# Altium project ENGG2800PCBSCHV3.PrjPcb (part 1 of 2)
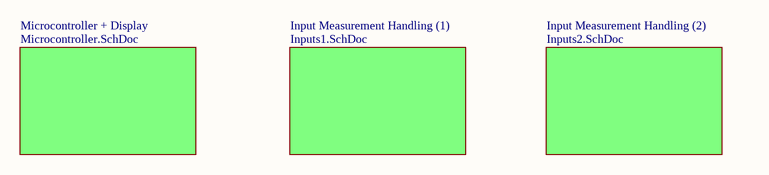
[diagram p0: TopSheet.SchDoc]
4 sheets, 121 parts. Net scope: global (net labels, ports and power ports of the same name join across sheets).
Board file: PCB1.PcbDoc
Sheets:
  TopSheet.SchDoc
    Microcontroller + Display = Microcontroller.SchDoc
    Input Measurement Handling (1) = Inputs1.SchDoc
    Input Measurement Handling (2) = Inputs2.SchDoc

## Sheet TopSheet.SchDoc
size A4; SheetNumber: 1; SheetTotal: 4

### Sub-sheets
Input Measurement Handling (1) = Inputs1.SchDoc: no entries
Input Measurement Handling (2) = Inputs2.SchDoc: no entries
Microcontroller + Display = Microcontroller.SchDoc: no entries

## Sheet Microcontroller.SchDoc
size A4; SheetNumber: 2; SheetTotal: 4
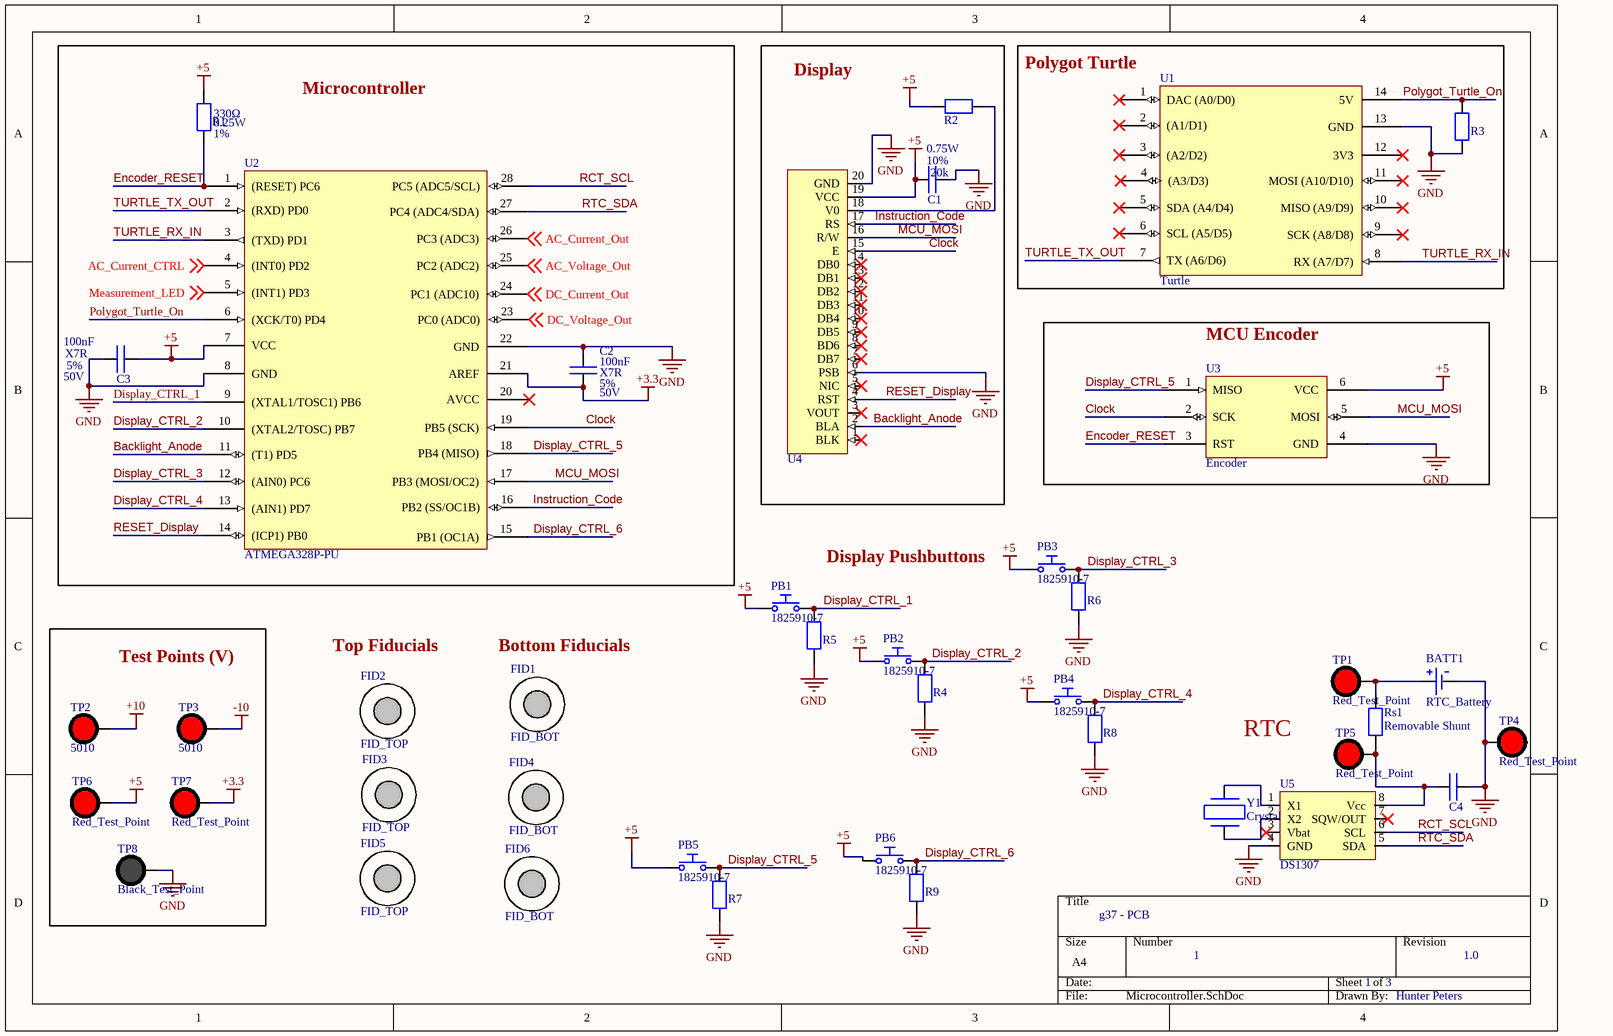
[diagram p1: Microcontroller.SchDoc]

### Parts
BATT1  RTC_Battery  [Battery Holder]
C1  Capacitor  [Capacitor]  (value not drawn)
C2  Capacitor  [Capacitor]  (value not drawn)
C3  Capacitor  [Capacitor]  (value not drawn)
C4  Capacitor  [Capacitor]  (value not drawn)
FID1  FID_BOT  [Fiducial_TOP]
FID2  FID_TOP  [Fiducial_TOP]
FID3  FID_TOP  [Fiducial_TOP]
FID4  FID_BOT  [Fiducial_TOP]
FID5  FID_TOP  [Fiducial_TOP]
FID6  FID_BOT  [Fiducial_TOP]
PB1  1825910-7  [Pushbutton]
PB2  1825910-7  [Pushbutton]
PB3  1825910-7  [Pushbutton]
PB4  1825910-7  [Pushbutton]
PB5  1825910-7  [Pushbutton]
PB6  1825910-7  [Pushbutton]
R1  Resistor  [Resistor]  (value not drawn)
R2  Resistor  [Resistor]  (value not drawn)
R3  Resistor  [Resistor]  (value not drawn)
R4  Resistor  [Resistor]  (value not drawn)
R5  Resistor  [Resistor]  (value not drawn)
R6  Resistor  [Resistor]  (value not drawn)
R7  Resistor  [Resistor]  (value not drawn)
R8  Resistor  [Resistor]  (value not drawn)
R9  Resistor  [Resistor]  (value not drawn)
Rs1  Removable Shunt  [Current_Shunt]
TP1  Red_Test_Point  [TP]
TP2  5010  [TP]
TP3  5010  [TP]
TP4  Red_Test_Point  [TP]
TP5  Red_Test_Point  [TP]
TP6  Red_Test_Point  [TP]
TP7  Red_Test_Point  [TP]
TP8  Black_Test_Point  [TP]
U1  Turtle  [Polygot-Turtle]
U2  ATMEGA328P-PU  [ATMEGA832P\]
U3  Encoder  [Encoder_No_Breakout]
U4  LED Display  [LED Display]  (value not drawn)
U5  DS1307  [Op Amp]
Y1  Crystal  [Crystal]

### Blocks framed on the sheet
Microcontroller: C2 C3 R1 U2
Display: C1 R2 U4
Polygot Turtle: R3 U1
MCU Encoder: U3
Test Points (V): TP2 TP3 TP6-TP8

### Nets
+3.3: C2.1 TP7.1 U2.21(AREF)
+5: C1.1 C3.1 PB1.1 PB2.1 PB3.1 PB4.1 PB5.1 PB6.1 R1.1 R2.1 TP6.1 U2.7(VCC) U3.6(VCC) U4.19(VCC)
+10: TP2.1
-10: TP3.1
GND: BATT1.2 C1.2 C2.2 C3.2 C4.2 R3.1 R4.1 R5.1 R6.1 R7.1 R8.1 R9.1 TP4.1 TP8.1 U1.13(GND) U2.8(GND) U2.22(GND) U3.4(GND) U4.6(PSB) U4.20(GND) U5.4(GND)
AC_Current_CTRL: U2.4((INT0)_PD2) ; off-sheet AC_Current_CTRL
AC_Current_Out: U2.26(PC3_(ADC3)) ; off-sheet AC_Current_Out
AC_Voltage_Out: U2.25(PC2_(ADC2)) ; off-sheet AC_Voltage_Out
Backlight_Anode: U2.11((T1)_PD5) U4.2(BLA)
Clock: U2.19(PB5_(SCK)) U3.2(SCK) U4.15(E)
DC_Current_Out: U2.24(PC1_(ADC10)) ; off-sheet DC_Current_Out
DC_Voltage_Out: U2.23(PC0_(ADC0)) ; off-sheet DC_Voltage_Out
Display_CTRL_1: PB1.2 R5.2 U2.9((XTAL1/TOSC1)_PB6)
Display_CTRL_2: PB2.2 R4.2 U2.10((XTAL2/TOSC)_PB7)
Display_CTRL_3: PB3.2 R6.2 U2.12((AIN0)_PC6)
Display_CTRL_4: PB4.2 R8.2 U2.13((AIN1)_PD7)
Display_CTRL_5: PB5.2 R7.2 U2.18(PB4_(MISO)) U3.1(MISO)
Display_CTRL_6: PB6.2 R9.2 U2.15(PB1_(OC1A))
Encoder_RESET: R1.2 U2.1((RESET)_PC6) U3.3(RST)
Instruction_Code: U2.16(PB2_(SS/OC1B)) U4.17(RS)
MCU_MOSI: U2.17(PB3_(MOSI/OC2)) U3.5(MOSI) U4.16(R/W)
Measurement_LED: U2.5((INT1)_PD3) ; off-sheet Measurement_LED
Polygot_Turtle_On: R3.2 U1.14(5V) U2.6((XCK/T0)_PD4)
RCT_SCL: U2.28(PC5_(ADC5/SCL)) U5.6(SCL)
RESET_Display: U2.14((ICP1)_PB0) U4.4(RST)
RTC_SDA: U2.27(PC4_(ADC4/SDA)) U5.5(SDA)
TURTLE_RX_IN: U1.8(RX_(A7/D7)) U2.3((TXD)_PD1)
TURTLE_TX_OUT: U1.7(TX_(A6/D6)) U2.2((RXD)_PD0)
NetBATT1_1: BATT1.1 Rs1.2 TP1.1
NetC4_1: C4.1 Rs1.1 TP5.1 U5.8(Vcc)
NetR2_2: R2.2 U4.18(V0)
NetU5_1: U5.1(X1) Y1.2
NetU5_2: U5.2(X2) Y1.1

Not connected (* = marked no-connect by the designer): U1 1(DAC_(A0/D0))* 2((A1/D1))* 3((A2/D2))* 4((A3/D3))* 5(SDA_(A4/D4))* 6(SCL_(A5/D5))* 9(SCK_(A8/D8))* 10(MISO_(A9/D9))* 11(MOSI_(A10/D10))* 12(3V3)*; U2 20(AVCC)*; U4 1(BLK)* 3(VOUT)* 5(NIC)* 7(DB7)* 8(BD6)* 9(DB5)* 10(DB4)* 11(DB3)* 12(DB2)* 13(DB1)* 14(DB0)*; U5 3(Vbat)* 7(SQW/OUT)*

### Notes on the sheet
- (near R1) 330Ω
- (near R1) 0.25W
- (near R1) 1%
- 0.75W
- (near C1) 10%
- (near C1) 20k
- (near C3) 100nF
- (near C3) 50V
- (near C3) X7R
- (near C3) 5%
- (near C2) 100nF
- (near C2) X7R
- (near C2) 5%
- (near C2) 50V
- Display Pushbuttons
- Top Fiducials
- (near FID1) Bottom Fiducials
- RTC
- g37 - PCB
- 1
- 3
- 1.0
- Hunter Peters

### Library data of the parts
FID1 FID4 FID6 = FID_Bottom
PB1-PB6 = 1825910-7: Keypad Switch, 1 Switches, SPST, Momentary, 0.05A, 24VDC, 2.548N, Solder Terminal, Panel Mount; Manufacturer: TE Connectivity; Manufacturer Lifecycle Status: ACTIVE; Actuator Length: 1.397mm; Actuator Material: PBT; Contact Current Rating: 50mA; Contact Resistance: 100mΩ; Electrical Life: 100kcycles; Illumination Type: Illuminated, Non-Illuminated; Max Voltage Rating (DC): 24V; Number of Positions: 1; Switch Function: Off-Mom; Switch Travel: 250µm; Supplier 1: DigiKey; Manufacturer Part Number: 1825910-7; RoHS: Compliant; Category: Pushbutton Switches; Stock 1: 35870; Pricing 1: 1=0.13, 10=0.118, 25=0.1112, 100=0.1001, 250=0.093, 750=0.08485, 1500=0.08009, 3000=0.07565, 5250=0.07234 (USD); China RoHS: Compliant; Color: Black, Red; Contact Material: Silver; Contact Plating: Silver; Current Rating: 50mA; Depth: 7.8mm; Export Control Classification Number (ECCN) Code: EAR99; ELV: Compliant; Height: 3.61mm; Housing Material: Nylon; Harmonized Tariff Schedule (HTS) Code: 8536.50.90.40; Introduction Date: 2008-01-30; Lead Free: Lead Free; Length: 5.99mm; Lifecycle Status: Production; Max Current Rating: 50mA; Max Operating Temperature: 85°C; Mechanical Life: 100kcycles; Min Operating Temperature: -35°C; Mount: Surface Mount, Through Hole; Operating Force: 2.548N; Orientation: Straight; Packaging: Bulk; Radiation Hardening: No; REACH SVHC: Yes; Schedule B: 8536509065, 8536509065|8536509065|8536509065|8536509065|8536509065|8536509065|8536509065|8536509065|8536509065|8536509065|8536509065|8536509065|8536509065|8536509065|8536509065|8536509065|8536509065|8536509065|8536509065|8536509065|8536509065|8536509065|8536509065|85; Termination: PC Pins, Solder; Throw Configuration: SPST; Type: Switch; Voltage Rating (DC): 24V; ComponentLink1URL: https://datasheet.octopart.com:443/1825910-7-TE-Connectivity-datasheet-179971976.pdf?src-supplier=IHS; ComponentLink1Description: https://datasheet.octopart.com:443/1825910-7-TE-Connectivity-datasheet-179971976.pdf?src-supplier=IHS; ComponentLink2URL: https://sigma.octopart.com:443/101748000/technical_drawing/TE-Connectivity-1825910-7.pdf?src-supplier=Sager+Electronics; ComponentLink2Description: https://sigma.octopart.com:443/101748000/technical_drawing/TE-Connectivity-1825910-7.pdf?src-supplier=Sager+Electronics; ComponentLink3URL: https://sigma.octopart.com:443/12291753/technical_drawing/TE-Connectivity-1825910-7.pdf?src-supplier=TE+Connectivity; ComponentLink3Description: https://sigma.octopart.com:443/12291753/technical_drawing/TE-Connectivity-1825910-7.pdf?src-supplier=TE+Connectivity; ComponentLink4URL: https://datasheet.octopart.com:443/1825910-7-TE-Connectivity-datasheet-10294628.pdf?src-supplier=Newark; ComponentLink4Description: https://datasheet.octopart.com:443/1825910-7-TE-Connectivity-datasheet-10294628.pdf?src-supplier=Newark; ComponentLink5URL: https://sigma.octopart.com:443/58177301/technical_drawing/TE-Connectivity-1825910-7.pdf?src-supplier=Farnell; ComponentLink5Description: https://sigma.octopart.com:443/58177301/technical_drawing/TE-Connectivity-1825910-7.pdf?src-supplier=Farnell; ComponentLink6URL: https://datasheet.octopart.com:443/1825910-7-TE-Connectivity---Alcoswitch-datasheet-33021037.pdf?src-supplier=Farnell; ComponentLink6Description: https://datasheet.octopart.com:443/1825910-7-TE-Connectivity---Alcoswitch-datasheet-33021037.pdf?src-supplier=Farnell; ComponentLink7URL: https://datasheet.octopart.com:443/1825910-7-TE-Connectivity---AMP-datasheet-23715109.pdf?src-supplier=Electro+Sonic; ComponentLink7Description: https://datasheet.octopart.com:443/1825910-7-TE-Connectivity---AMP-datasheet-23715109.pdf?src-supplier=Electro+Sonic; ComponentLink8URL: https://datasheet.octopart.com:443/1825910-7-TE-Connectivity-datasheet-145419879.pdf?src-supplier=RS+(Formerly+Allied+Electronics); ComponentLink8Description: https://datasheet.octopart.com:443/1825910-7-TE-Connectivity-datasheet-145419879.pdf?src-supplier=RS+(Formerly+Allied+Electronics); ComponentLink9URL: https://datasheet.octopart.com:443/1825910-7-TE-Connectivity---AMP-datasheet-189108451.pdf?src-supplier=Master+Electronics; ComponentLink9Description: https://datasheet.octopart.com:443/1825910-7-TE-Connectivity---AMP-datasheet-189108451.pdf?src-supplier=Master+Electronics; ComponentLink10URL: http://sigma.octopart.com:80/14574254/rohs_statement/TE-Connectivity-1825910-7.pdf?src-supplier=Compliance+Statements; ComponentLink10Description: http://sigma.octopart.com:80/14574254/rohs_statement/TE-Connectivity-1825910-7.pdf?src-supplier=Compliance+Statements; ComponentLink11URL: http://sigma.octopart.com:80/41598134/materials_sheet/TE-Connectivity-1825910-7.pdf?src-supplier=Compliance+Statements; ComponentLink11Description: http://sigma.octopart.com:80/41598134/materials_sheet/TE-Connectivity-1825910-7.pdf?src-supplier=Compliance+Statements; Supplier Part Number 1: 450-1804-ND
Rs1 = Current_Test_Shunt: Current_Shunt
TP2 TP3 = Red_Test_Point
U1 = 102010328: SAMD21 Microcontroller Development Board 0.0327MHz/48MHzCPU 32KB RAM 256KB Flash; Manufacturer: Seeed Studio; Supplier 1: DigiKey; Manufacturer Part Number: 102010328; Category: DSPs - Digital Signal Processors; Stock 1: 4270; Pricing 1: 1=5.4 (USD); Schedule B: 8471490000; Supplier Part Number 1: 1597-102010328-ND
U2 = ATMEGA328P-PU: Microchip - ATMEGA328P-PU - Microcontroller Mcu, 8 Bit, Atmega, 20MHZ, DIP-28; Manufacturer Lifecycle Status: REL; Core Architecture: AVR; Data Bus Width: 8b; Interface: 2-Wire, I2C, SPI, UART, USART; Max Supply Voltage: 5.5V; Memory Size: 32kB; Memory Type: FLASH; Min Supply Voltage: 1.8V; Number of ADC Channels: 6; Number of I2C Channels: 1; Number of I/Os: 23; Number of Timers/Counters: 3; Oscillator Type: Internal; Peripherals: Brown-out Detect/Reset, POR, PWM, WDT; RAM Size: 2kB; Watchdog Timer: Yes; Supplier 1: DigiKey; Manufacturer: Microchip; Manufacturer Part Number: ATMEGA328P-PU; RoHS: Compliant; Category: Microcontrollers; Stock 1: 49916; Pricing 1: 1=2.89, 25=2.65, 100=2.39 (USD); Projected EOL Date: 2039-11-04; Case/Package: PDIP; Contact Plating: Tin; Country of Assembly: Thailand; Country of Fabrication: United States of America; Country of Origin: Thailand; Export Control Classification Number (ECCN) Code: EAR99; Frequency: 20MHz; Height: 3.28mm; Harmonized Tariff Schedule (HTS) Code: 8542.31.0015; Lead Free: Lead Free; Length: 37.4mm; Lifecycle Status: Production; Max Frequency: 20MHz; Max Operating Temperature: 85°C; Min Operating Temperature: -40°C; Mount: Through Hole; Number of Pins: 28; Number of Programmable I/O: 23; Number of PWM Channels: 6; Number of SPI Channels: 1; Radiation Hardening: No; REACH SVHC: No; Schedule B: 8542310000, 8542310000|8542310000|8542310000|8542310000|8542310000; Width: 6.76mm; ComponentLink1URL: https://datasheet.octopart.com:443/ATMEGA328P-PU-Microchip-datasheet-147334532.pdf?src-supplier=Microchip; ComponentLink1Description: https://datasheet.octopart.com:443/ATMEGA328P-PU-Microchip-datasheet-147334532.pdf?src-supplier=Microchip; ComponentLink2URL: https://datasheet.octopart.com:443/ATMEGA328P-PU-Microchip-datasheet-148646239.pdf?src-supplier=Microchip; ComponentLink2Description: https://datasheet.octopart.com:443/ATMEGA328P-PU-Microchip-datasheet-148646239.pdf?src-supplier=Microchip; ComponentLink3URL: https://datasheet.octopart.com:443/ATMEGA328P-PU-Microchip-datasheet-68295846.pdf?src-supplier=SHENGYU+ELECTRONICS; ComponentLink3Description: https://datasheet.octopart.com:443/ATMEGA328P-PU-Microchip-datasheet-68295846.pdf?src-supplier=SHENGYU+ELECTRONICS; ComponentLink4URL: https://datasheet.octopart.com:443/ATMEGA328P-PU-Microchip-datasheet-14421303.pdf?src-supplier=Upverter; ComponentLink4Description: https://datasheet.octopart.com:443/ATMEGA328P-PU-Microchip-datasheet-14421303.pdf?src-supplier=Upverter; ComponentLink5URL: https://datasheet.octopart.com:443/ATMEGA328P-PU-Atmel-datasheet-34147914.pdf?src-supplier=Upverter; ComponentLink5Description: https://datasheet.octopart.com:443/ATMEGA328P-PU-Atmel-datasheet-34147914.pdf?src-supplier=Upverter; ComponentLink6URL: https://datasheet.octopart.com:443/ATMEGA328P-PU-Atmel-datasheet-14353408.pdf?src-supplier=Upverter; ComponentLink6Description: https://datasheet.octopart.com:443/ATMEGA328P-PU-Atmel-datasheet-14353408.pdf?src-supplier=Upverter; ComponentLink7URL: https://datasheet.octopart.com:443/ATMEGA328P-PU-Microchip-datasheet-133520744.pdf?src-supplier=LKR; ComponentLink7Description: https://datasheet.octopart.com:443/ATMEGA328P-PU-Microchip-datasheet-133520744.pdf?src-supplier=LKR; ComponentLink8URL: https://datasheet.octopart.com:443/ATMEGA328P-PU-Microchip-datasheet-62316222.pdf?src-supplier=element14+APAC; ComponentLink8Description: https://datasheet.octopart.com:443/ATMEGA328P-PU-Microchip-datasheet-62316222.pdf?src-supplier=element14+APAC; ComponentLink9URL: https://datasheet.octopart.com:443/ATMEGA328P-PU-Atmel-datasheet-13381135.pdf?src-supplier=element14+APAC; ComponentLink9Description: https://datasheet.octopart.com:443/ATMEGA328P-PU-Atmel-datasheet-13381135.pdf?src-supplier=element14+APAC; ComponentLink10URL: https://datasheet.octopart.com:443/ATMEGA328P-PU-Microchip-datasheet-154741723.pdf?src-supplier=Electro+Sonic; ComponentLink10Description: https://datasheet.octopart.com:443/ATMEGA328P-PU-Microchip-datasheet-154741723.pdf?src-supplier=Electro+Sonic; ComponentLink11URL: https://datasheet.octopart.com:443/ATMEGA328P-PU-Microchip-datasheet-100453898.pdf?src-supplier=Burklin+Elektronik; ComponentLink11Description: https://datasheet.octopart.com:443/ATMEGA328P-PU-Microchip-datasheet-100453898.pdf?src-supplier=Burklin+Elektronik; ComponentLink12URL: https://datasheet.octopart.com:443/ATMEGA328P-PU-Atmel-datasheet-30457899.pdf?src-supplier=Seeed+Studio; ComponentLink12Description: https://datasheet.octopart.com:443/ATMEGA328P-PU-Atmel-datasheet-30457899.pdf?src-supplier=Seeed+Studio; ComponentLink13URL: https://datasheet.octopart.com:443/ATMEGA328P-PU-Microchip-datasheet-10842036.pdf?src-supplier=SOS+electronic; ComponentLink13Description: https://datasheet.octopart.com:443/ATMEGA328P-PU-Microchip-datasheet-10842036.pdf?src-supplier=SOS+electronic; ComponentLink14URL: https://datasheet.octopart.com:443/ATMEGA328P-PU-Microchip-datasheet-8364063.pdf?src-supplier=Jameco; ComponentLink14Description: https://datasheet.octopart.com:443/ATMEGA328P-PU-Microchip-datasheet-8364063.pdf?src-supplier=Jameco; ComponentLink15URL: https://datasheet.octopart.com:443/ATMEGA328P-PU-Microchip-datasheet-154323124.pdf?src-supplier=Jameco; ComponentLink15Description: https://datasheet.octopart.com:443/ATMEGA328P-PU-Microchip-datasheet-154323124.pdf?src-supplier=Jameco; ComponentLink16URL: https://datasheet.octopart.com:443/ATMEGA328P-PU-Atmel-datasheet-10389530.pdf?src-supplier=Newark; ComponentLink16Description: https://datasheet.octopart.com:443/ATMEGA328P-PU-Atmel-datasheet-10389530.pdf?src-supplier=Newark; ComponentLink17URL: https://datasheet.octopart.com:443/ATMEGA328P-PU-Microchip-datasheet-65729177.pdf?src-supplier=TME; ComponentLink17Description: https://datasheet.octopart.com:443/ATMEGA328P-PU-Microchip-datasheet-65729177.pdf?src-supplier=TME; ComponentLink18URL: https://datasheet.octopart.com:443/ATMEGA328P-PU-Microchip-datasheet-101746195.pdf?src-supplier=Future+Electronics; ComponentLink18Description: https://datasheet.octopart.com:443/ATMEGA328P-PU-Microchip-datasheet-101746195.pdf?src-supplier=Future+Electronics; ComponentLink19URL: http://sigma.octopart.com:80/188450569/materials_sheet/Microchip-ATMEGA328P-PU.pdf?src-supplier=Compliance+Statements; ComponentLink19Description: http://sigma.octopart.com:80/188450569/materials_sheet/Microchip-ATMEGA328P-PU.pdf?src-supplier=Compliance+Statements; ComponentLink20URL: http://sigma.octopart.com:80/rohs_statement/Microchip-company-71.pdf?src-supplier=Compliance+Statements; ComponentLink20Description: http://sigma.octopart.com:80/rohs_statement/Microchip-company-71.pdf?src-supplier=Compliance+Statements; ComponentLink21URL: http://sigma.octopart.com:80/reach_statement/Microchip-company-70.pdf?src-supplier=Compliance+Statements; ComponentLink21Description: http://sigma.octopart.com:80/reach_statement/Microchip-company-70.pdf?src-supplier=Compliance+Statements; ComponentLink22URL: http://sigma.octopart.com:80/conflict_mineral_statement/Microchip-company-69.pdf?src-supplier=Compliance+Statements; ComponentLink22Description: http://sigma.octopart.com:80/conflict_mineral_statement/Microchip-company-69.pdf?src-supplier=Compliance+Statements; ComponentLink23URL: http://sigma.octopart.com:80/conflict_mineral_statement/Microchip-company-68.pdf?src-supplier=Compliance+Statements; ComponentLink23Description: http://sigma.octopart.com:80/conflict_mineral_statement/Microchip-company-68.pdf?src-supplier=Compliance+Statements; ComponentLink24URL: http://sigma.octopart.com:80/reach_statement/Atmel-company-6.pdf?src-supplier=Compliance+Statements; ComponentLink24Description: http://sigma.octopart.com:80/reach_statement/Atmel-company-6.pdf?src-supplier=Compliance+Statements; ComponentLink25URL: http://sigma.octopart.com:80/rohs_statement/Atmel-company-5.pdf?src-supplier=Compliance+Statements; ComponentLink25Description: http://sigma.octopart.com:80/rohs_statement/Atmel-company-5.pdf?src-supplier=Compliance+Statements; ComponentLink26URL: http://sigma.octopart.com:80/rohs_statement/Atmel-company-4.pdf?src-supplier=Compliance+Statements; ComponentLink26Description: http://sigma.octopart.com:80/rohs_statement/Atmel-company-4.pdf?src-supplier=Compliance+Statements; Supplier Part Number 1: ATMEGA328P-PU-ND
U3 = 1465: Adafruit 6-Pin Avr Isp Breadboard Adapter Mini Kit |Adafruit 1465; Manufacturer: Adafruit Industries; Supplier 1: DigiKey; Manufacturer Part Number: 1465; RoHS: Compliant; Category: Uncategorized; Stock 1: 113; Pricing 1: 1=0.95 (USD); Schedule B: 8542900000, 8542900000|8542900000|8542900000|8542900000|8542900000; Supplier Part Number 1: 1528-1189-ND
U4 = Display
U5 = RTC

## Sheet Inputs1.SchDoc
size A4; SheetNumber: 3; SheetTotal: 4
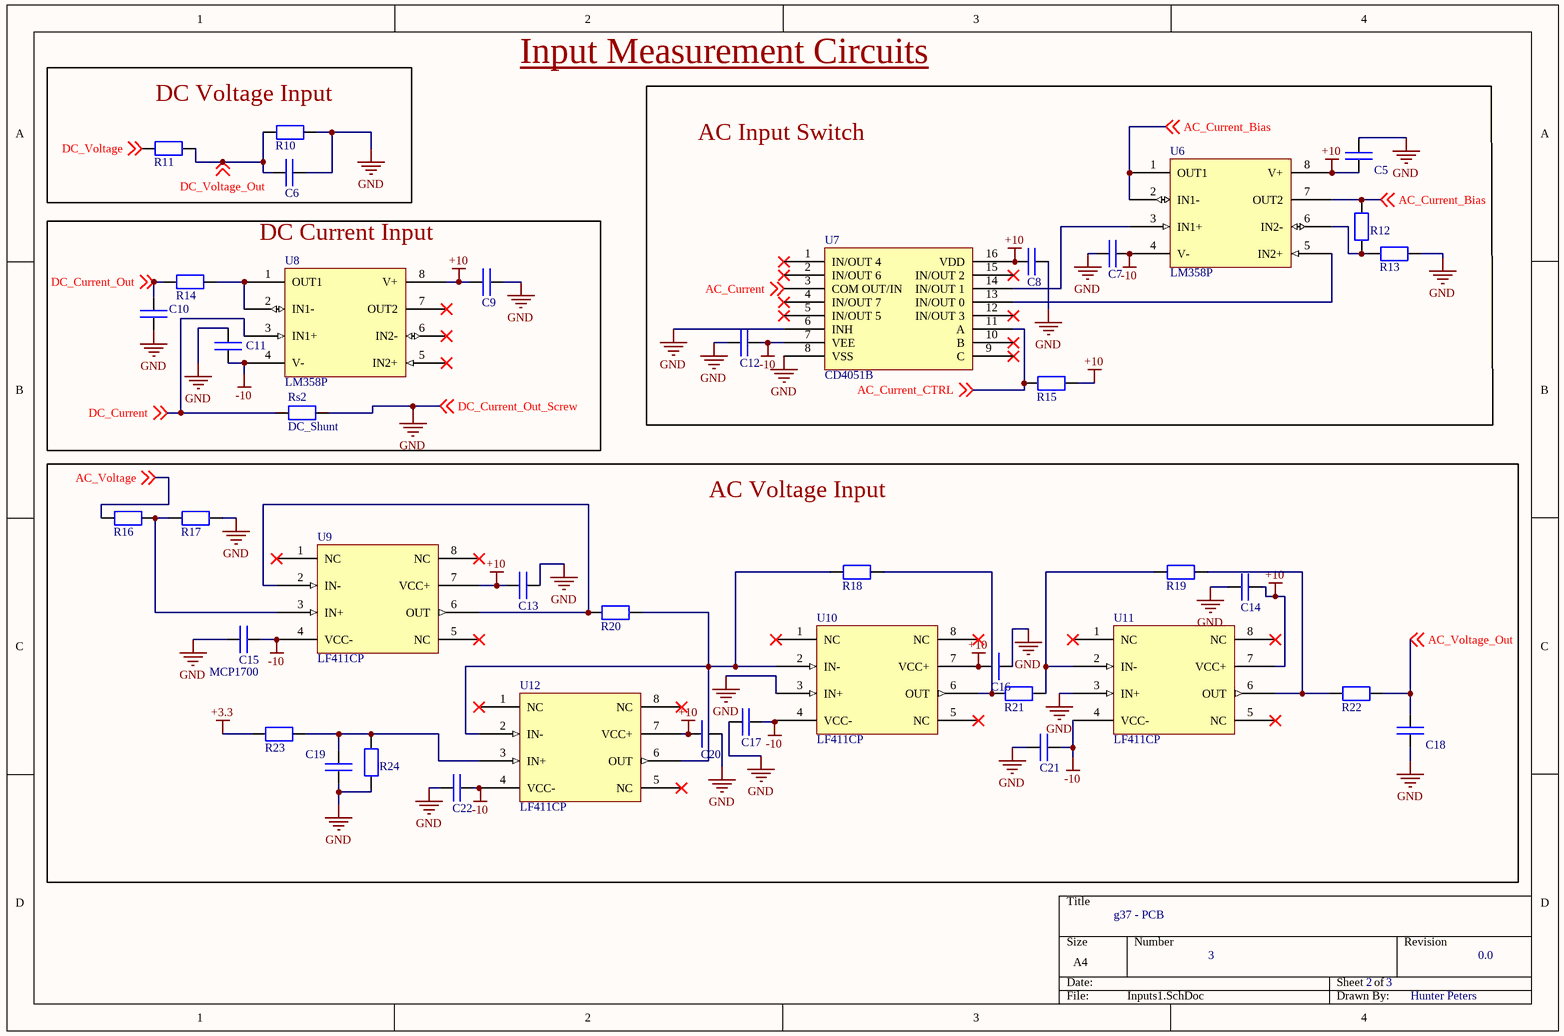
[diagram p2: Inputs1.SchDoc]

### Parts
C5  Capacitor  [Capacitor]  (value not drawn)
C6  Capacitor  [Capacitor]  (value not drawn)
C7  Capacitor  [Capacitor]  (value not drawn)
C8  Capacitor  [Capacitor]  (value not drawn)
C9  Capacitor  [Capacitor]  (value not drawn)
C10  Capacitor  [Capacitor]  (value not drawn)
C11  Capacitor  [Capacitor]  (value not drawn)
C12  Capacitor  [Capacitor]  (value not drawn)
C13  Capacitor  [Capacitor]  (value not drawn)
C14  Capacitor  [Capacitor]  (value not drawn)
C15  Capacitor  [Capacitor]  (value not drawn)
C16  Capacitor  [Capacitor]  (value not drawn)
C17  Capacitor  [Capacitor]  (value not drawn)
C18  Capacitor  [Capacitor]  (value not drawn)
C19  Capacitor  [Capacitor]  (value not drawn)
C20  Capacitor  [Capacitor]  (value not drawn)
C21  Capacitor  [Capacitor]  (value not drawn)
C22  Capacitor  [Capacitor]  (value not drawn)
R10  Resistor  [Resistor]  (value not drawn)
R11  Resistor  [Resistor]  (value not drawn)
R12  Resistor  [Resistor]  (value not drawn)
R13  Resistor  [Resistor]  (value not drawn)
R14  Resistor  [Resistor]  (value not drawn)
R15  4.7kΩ  [Resistor]  (value not drawn)
R16  Resistor  [Resistor]  (value not drawn)
R17  Resistor  [Resistor]  (value not drawn)
R18  Resistor  [Resistor]  (value not drawn)
R19  Resistor  [Resistor]  (value not drawn)
R20  Resistor  [Resistor]  (value not drawn)
R21  Resistor  [Resistor]  (value not drawn)
R22  Resistor  [Resistor]  (value not drawn)
R23  Resistor  [Resistor]  (value not drawn)
R24  Resistor  [Resistor]  (value not drawn)
Rs2  DC_Shunt  [DC_Shunt]
U6  LM358P  [Op Amp]
U7  CD4051B  [Multiplexor]
U8  LM358P  [Op Amp]
U9  LF411CP  [Op Amp]
U10  LF411CP  [Op Amp]
U11  LF411CP  [Op Amp]
U12  LF411CP  [Op Amp]

### Blocks framed on the sheet
DC Voltage Input: C6 R10 R11
AC Input Switch: C5 C7 C8 C12 R12 R13 R15 U6 U7
DC Current Input: C9-C11 R14 Rs2 U8
AC Voltage Input: C13-C22 R16-R24 U9-U12

### Nets
+3.3: R23.1
+10: C5.1 C8.1 C9.1 C13.1 C14.1 C16.1 C20.1 R15.2 U6.8(V+) U7.16(VDD) U8.8(V+) U9.7(VCC+) U10.7(VCC+) U11.7(VCC+) U12.7(VCC+)
-10: C7.2 C11.1 C12.2 C15.2 C17.2 C21.2 C22.2 U6.4(V-) U7.7(VEE) U8.4(V-) U9.4(VCC-) U10.4(VCC-) U11.4(VCC-) U12.4(VCC-)
GND: C5.2 C6.2 C7.1 C8.2 C9.2 C10.1 C11.2 C12.1 C13.2 C14.2 C15.1 C16.2 C17.1 C18.1 C19.1 C20.2 C21.1 C22.1 R10.2 R13.1 R17.2 R24.1 Rs2.2 U7.6(INH) U7.8(VSS) U10.3(IN+) U11.3(IN+) ; off-sheet DC_Current_Out_Screw  [also labelled DC_Current_Out_Screw]
AC_Current: U7.3(COM_OUT/IN) ; off-sheet AC_Current
AC_Current_Bias: R12.2 U6.1(OUT1) U6.2(IN1-) U6.7(OUT2) ; off-sheet AC_Current_Bias
AC_Current_CTRL: R15.1 U7.11(A) ; off-sheet AC_Current_CTRL
AC_Voltage: R16.1 ; off-sheet AC_Voltage
AC_Voltage_Out: C18.2 R22.2 ; off-sheet AC_Voltage_Out
DC_Current: Rs2.1 U8.3(IN1+) ; off-sheet DC_Current
DC_Current_Out: C10.2 R14.1 ; off-sheet DC_Current_Out
DC_Voltage: R11.2 ; off-sheet DC_Voltage
DC_Voltage_Out: C6.1 R10.1 R11.1 ; off-sheet DC_Voltage_Out
NetC19_2: C19.2 R23.2 R24.2 U12.3(IN+)
NetR12_1: R12.1 R13.2 U6.6(IN2-)
NetR14_2: R14.2 U8.1(OUT1) U8.2(IN1-)
NetR16_2: R16.2 R17.1 U9.3(IN+)
NetR18_1: R18.1 R20.2 U10.2(IN-) U12.2(IN-) U12.6(OUT)
NetR18_2: R18.2 R21.1 U10.6(OUT)
NetR19_1: R19.1 R21.2 U11.2(IN-)
NetR19_2: R19.2 R22.1 U11.6(OUT)
NetR20_1: R20.1 U9.2(IN-) U9.6(OUT)
NetU6_3: U6.3(IN1+) U7.14(IN/OUT_1)
NetU6_5: U6.5(IN2+) U7.13(IN/OUT_0)

Not connected (* = marked no-connect by the designer): U7 1(IN/OUT_4)* 2(IN/OUT_6)* 4(IN/OUT_7)* 5(IN/OUT_5)* 9(C)* 10(B)* 12(IN/OUT_3)* 15(IN/OUT_2)*; U8 5(IN2+)* 6(IN2-)* 7(OUT2)*; U9 1(NC)* 5(NC)* 8(NC)*; U10 1(NC)* 5(NC)* 8(NC)*; U11 1(NC)* 5(NC)* 8(NC)*; U12 1(NC)* 5(NC)* 8(NC)*

### Notes on the sheet
- Input Measurement Circuits
- (near C15) MCP1700
- g37 - PCB
- 3
- 2
- 0.0
- Hunter Peters

### Library data of the parts
R15 = Resistor
U6 U8 = LM358P: Operational Amplifier, Dual, 700 Khz, 2, 0.4 V/ S, 1.5V To 16V, Dip, 8 Rohs Compliant: Yes; Manufacturer: Texas Instruments; Manufacturer Lifecycle Status: ACTIVE; Bandwidth: 1MHz; Common Mode Rejection Ratio: 65dB; Dual Supply Voltage: 9V; Gain Bandwidth Product: 700kHz; Input Bias Current: 250nA; Input Offset Voltage (Vos): 7mV; Max Supply Current: 700µA; Max Supply Voltage: 32V; Min Supply Voltage: 3V; Nominal Supply Current: 1.2mA; Number of Amplifiers: 2; Operating Supply Current: 1mA; Output Current: 30mA; Slew Rate: 0.3V/µs; Voltage Gain: 100dB; Supplier 1: DigiKey; Manufacturer Part Number: LM358P; RoHS: Compliant; Category: Amplifiers - Op Amps, Buffer, Instrumentation; Stock 1: 72654; Pricing 1: 1=0.27, 10=0.187, 50=0.153, 100=0.1423, 250=0.13104, 500=0.12426, 1000=0.11868, 2500=0.11278, 5000=0.1102 (USD); Case/Package: PDIP; Contact Plating: Gold; Height: 5.08mm; Lead Free: Lead Free; Length: 9.81mm; Lifecycle Status: Production; Max Dual Supply Voltage: 16V; Max Operating Temperature: 70°C; Min Dual Supply Voltage: 1.5V; Min Operating Temperature: 0°C; Mount: Through Hole; Number of Channels: 2; Number of Circuits: 2; Number of Elements: 2; Number of Pins: 8; Operating Supply Voltage: 16V; Output Current per Channel: 30mA; Power Supply Rejection Ratio (PSRR): 65dB; Radiation Hardening: No; REACH SVHC: No; Schedule B: 8542330000, 8542330000|8542330000|8542330000|8542330000|8542330000|8542330000|8542330000|8542330000|8542330000|8542330000|8542330000|8542330000|8542330000|8542330000|8542330000|8542330000|8542330000|8542330000|8542330000|8542330000|8542330000|8542330000|8542330000|85; Thickness: 3.9mm; Width: 6.35mm; ComponentLink1URL: https://datasheet.octopart.com:443/LM358P-Texas-Instruments-datasheet-22122189.pdf?src-supplier=Texas+Instruments; ComponentLink1Description: https://datasheet.octopart.com:443/LM358P-Texas-Instruments-datasheet-22122189.pdf?src-supplier=Texas+Instruments; ComponentLink2URL: https://octopart.com:443/opatz8j6/c1?t=oqAI8rLcFpUCwQz3XpiQyJu6cvQHEZqsQz-ajVCN9ANwwKTOsKfzA42PIMJelGWuzT3h6SD-c6fpyT0gSSX2jEno0skou8v9j3Jn_12a0HifiHKIe5xyb9D0ZmJu35xXUPkKHYTg9gNLLOZNL_ZRlu9lopCJkqKAh8-EcsD-mij-HCuIcf6e5wcGllE6vrwhH9FYTnOeC7BJcBEDEy-SR6Gf13-dAeqi_gwlv4VpfKxqzu3VdIKpO-63Eg9hZr4wxMFv42TwUYIo25Tt9ZzY3CMy4ptzf0nP6hbmpRkagDXPpxp0_YPC_pQDbKIScxns-zstyRPAOYYCKtuU7TPlFeKjWR049V7cUehsluTRxHTQ5ZZ8Ynx5nPbUd9yzTscO&src-supplier=Texas+Instruments; ComponentLink2Description: https://octopart.com:443/opatz8j6/c1?t=oqAI8rLcFpUCwQz3XpiQyJu6cvQHEZqsQz-ajVCN9ANwwKTOsKfzA42PIMJelGWuzT3h6SD-c6fpyT0gSSX2jEno0skou8v9j3Jn_12a0HifiHKIe5xyb9D0ZmJu35xXUPkKHYTg9gNLLOZNL_ZRlu9lopCJkqKAh8-EcsD-mij-HCuIcf6e5wcGllE6vrwhH9FYTnOeC7BJcBEDEy-SR6Gf13-dAeqi_gwlv4VpfKxqzu3VdIKpO-63Eg9hZr4wxMFv42TwUYIo25Tt9ZzY3CMy4ptzf0nP6hbmpRkagDXPpxp0_YPC_pQDbKIScxns-zstyRPAOYYCKtuU7TPlFeKjWR049V7cUehsluTRxHTQ5ZZ8Ynx5nPbUd9yzTscO&src-supplier=Texas+Instruments; ComponentLink3URL: https://sigma.octopart.com:443/49250158/technical_drawing/Texas-Instruments-LM358P.pdf?src-supplier=Texas+Instruments; ComponentLink3Description: https://sigma.octopart.com:443/49250158/technical_drawing/Texas-Instruments-LM358P.pdf?src-supplier=Texas+Instruments; ComponentLink4URL: https://datasheet.octopart.com:443/LM358P-Texas-Instruments-datasheet-149604.pdf?src-supplier=Upverter; ComponentLink4Description: https://datasheet.octopart.com:443/LM358P-Texas-Instruments-datasheet-149604.pdf?src-supplier=Upverter; ComponentLink5URL: https://datasheet.octopart.com:443/LM358P-Texas-Instruments-datasheet-16079558.pdf?src-supplier=Upverter; ComponentLink5Description: https://datasheet.octopart.com:443/LM358P-Texas-Instruments-datasheet-16079558.pdf?src-supplier=Upverter; ComponentLink6URL: https://datasheet.octopart.com:443/LM358P-Texas-Instruments-datasheet-81454335.pdf?src-supplier=Farnell; ComponentLink6Description: https://datasheet.octopart.com:443/LM358P-Texas-Instruments-datasheet-81454335.pdf?src-supplier=Farnell; ComponentLink7URL: https://datasheet.octopart.com:443/LM358P.-Texas-Instruments-datasheet-65712975.pdf?src-supplier=Farnell; ComponentLink7Description: https://datasheet.octopart.com:443/LM358P.-Texas-Instruments-datasheet-65712975.pdf?src-supplier=Farnell; ComponentLink8URL: https://datasheet.octopart.com:443/LM358P.-Texas-Instruments-datasheet-32750560.pdf?src-supplier=Farnell; ComponentLink8Description: https://datasheet.octopart.com:443/LM358P.-Texas-Instruments-datasheet-32750560.pdf?src-supplier=Farnell; ComponentLink9URL: https://datasheet.octopart.com:443/LM358P-Texas-Instruments-datasheet-10672735.pdf?src-supplier=Farnell; ComponentLink9Description: https://datasheet.octopart.com:443/LM358P-Texas-Instruments-datasheet-10672735.pdf?src-supplier=Farnell; ComponentLink10URL: https://datasheet.octopart.com:443/LM358P..-Texas-Instruments-datasheet-36780029.pdf?src-supplier=element14+APAC; ComponentLink10Description: https://datasheet.octopart.com:443/LM358P..-Texas-Instruments-datasheet-36780029.pdf?src-supplier=element14+APAC; ComponentLink11URL: https://datasheet.octopart.com:443/LM358P-Texas-Instruments-datasheet-2970.pdf?src-supplier=DigiKey; ComponentLink11Description: https://datasheet.octopart.com:443/LM358P-Texas-Instruments-datasheet-2970.pdf?src-supplier=DigiKey; ComponentLink12URL: https://datasheet.octopart.com:443/LM358P-Texas-Instruments-datasheet-159115118.pdf?src-supplier=LCSC; ComponentLink12Description: https://datasheet.octopart.com:443/LM358P-Texas-Instruments-datasheet-159115118.pdf?src-supplier=LCSC; ComponentLink13URL: https://datasheet.octopart.com:443/LM358P-Texas-Instruments-datasheet-147835639.pdf?src-supplier=SHENGYU+ELECTRONICS; ComponentLink13Description: https://datasheet.octopart.com:443/LM358P-Texas-Instruments-datasheet-147835639.pdf?src-supplier=SHENGYU+ELECTRONICS; ComponentLink14URL: https://datasheet.octopart.com:443/LM358P-Texas-Instruments-datasheet-101363746.pdf?src-supplier=Megastar; ComponentLink14Description: https://datasheet.octopart.com:443/LM358P-Texas-Instruments-datasheet-101363746.pdf?src-supplier=Megastar; ComponentLink15URL: https://datasheet.octopart.com:443/LM358P-Texas-Instruments-datasheet-137316104.pdf?src-supplier=Future+Electronics; ComponentLink15Description: https://datasheet.octopart.com:443/LM358P-Texas-Instruments-datasheet-137316104.pdf?src-supplier=Future+Electronics; ComponentLink16URL: https://datasheet.octopart.com:443/LM358P-Texas-Instruments-datasheet-21220556.pdf?src-supplier=Newark; ComponentLink16Description: https://datasheet.octopart.com:443/LM358P-Texas-Instruments-datasheet-21220556.pdf?src-supplier=Newark; ComponentLink17URL: https://datasheet.octopart.com:443/LM358P-Texas-Instruments-datasheet-14137277.pdf?src-supplier=iiiC; ComponentLink17Description: https://datasheet.octopart.com:443/LM358P-Texas-Instruments-datasheet-14137277.pdf?src-supplier=iiiC; ComponentLink18URL: https://datasheet.octopart.com:443/LM358P-Texas-Instruments-datasheet-10086281.pdf?src-supplier=element14; ComponentLink18Description: https://datasheet.octopart.com:443/LM358P-Texas-Instruments-datasheet-10086281.pdf?src-supplier=element14; ComponentLink19URL: https://datasheet.octopart.com:443/LM358P-Texas-Instruments-datasheet-8861238.pdf?src-supplier=element14; ComponentLink19Description: https://datasheet.octopart.com:443/LM358P-Texas-Instruments-datasheet-8861238.pdf?src-supplier=element14; ComponentLink20URL: https://datasheet.octopart.com:443/LM358P-Texas-Instruments-datasheet-8728431.pdf?src-supplier=element14; ComponentLink20Description: https://datasheet.octopart.com:443/LM358P-Texas-Instruments-datasheet-8728431.pdf?src-supplier=element14; ComponentLink21URL: https://datasheet.octopart.com:443/LM358P-Texas-Instruments-datasheet-8637033.pdf?src-supplier=element14; ComponentLink21Description: https://datasheet.octopart.com:443/LM358P-Texas-Instruments-datasheet-8637033.pdf?src-supplier=element14; ComponentLink22URL: https://datasheet.octopart.com:443/LM358P-Texas-Instruments-datasheet-17597669.pdf?src-supplier=TME; ComponentLink22Description: https://datasheet.octopart.com:443/LM358P-Texas-Instruments-datasheet-17597669.pdf?src-supplier=TME; ComponentLink23URL: https://datasheet.octopart.com:443/LM358P-Texas-Instruments-datasheet-8220297.pdf?src-supplier=Jameco; ComponentLink23Description: https://datasheet.octopart.com:443/LM358P-Texas-Instruments-datasheet-8220297.pdf?src-supplier=Jameco; ComponentLink24URL: https://datasheet.octopart.com:443/LM358P-Texas-Instruments-datasheet-111658.pdf?src-supplier=Sierra+IC; ComponentLink24Description: https://datasheet.octopart.com:443/LM358P-Texas-Instruments-datasheet-111658.pdf?src-supplier=Sierra+IC; ComponentLink25URL: http://sigma.octopart.com:80/reach_statement/Texas-Instruments-company-64.pdf?src-supplier=Compliance+Statements; ComponentLink25Description: http://sigma.octopart.com:80/reach_statement/Texas-Instruments-company-64.pdf?src-supplier=Compliance+Statements; ComponentLink26URL: http://sigma.octopart.com:80/conflict_mineral_statement/Texas-Instruments-company-63.pdf?src-supplier=Compliance+Statements; ComponentLink26Description: http://sigma.octopart.com:80/conflict_mineral_statement/Texas-Instruments-company-63.pdf?src-supplier=Compliance+Statements; Supplier Part Number 1: 296-1395-5-ND
U7 = CD4051BE: CD4051B Series 20 V 100 nA CMOS Single 8-Channel Analog Multiplexer - PDIP-16; Manufacturer: Texas Instruments; Manufacturer Lifecycle Status: ACTIVE; Bandwidth: 20MHz; Drain to Source Resistance: 240Ω; Dual Supply Voltage: 3V; Logic Function: Demultiplexer, Multiplexer, Mux; Max Dual Supply Voltage: 9V; Max Supply Voltage: 20V; Min Dual Supply Voltage: 2.5V; Nominal Supply Current: 80nA; Number of Bits: 8; Number of Circuits: 1; Operating Supply Voltage: 18V; Polarity: Non-Inverting; Propagation Delay: 60ns; Supply Type: Dual, Single; Turn-Off Delay Time: 450ns; Turn-On Delay Time: 720ns; Supplier 1: DigiKey; Manufacturer Part Number: CD4051BE; RoHS: Compliant; Category: Analog Switches and Multiplexers; Stock 1: 4495; Pricing 1: 1=0.8, 10=0.568, 25=0.5108, 100=0.4479, 250=0.41796, 500=0.3999, 1000=0.38504, 2500=0.36936, 5000=0.35991 (USD); Case/Package: PDIP; Contact Plating: Tin; Height: 5.08mm; Lead Free: Lead Free; Length: 19.3mm; Lifecycle Status: Production; Max Operating Temperature: 125°C; Min Operating Temperature: -55°C; Min Supply Voltage: 3V; Min Supply Voltage (DC): 3V; Mount: Through Hole; Number of Channels: 8; Number of Gates: 1; Number of Inputs: 8; Number of Pins: 16; Operating Supply Current: 80nA; Quiescent Current: 80nA; Radiation Hardening: No; REACH SVHC: No; Resistance: 240Ω; Schedule B: 8542390000, 8542390000|8542390000|8542390000|8542390000|8542390000|8542390000|8542390000|8542390000|8542390000|8542390000|8542390000|8542390000|8542390000|8542390000|8542390000|8542390000|8542390000|8542390000|8542390000|8542390000|8542390000|8542390000|8542390000|85; Thickness: 3.9mm; Weight: 951.693491mg; Width: 6.35mm; ComponentLink1URL: https://datasheet.octopart.com:443/CD4051BE-Texas-Instruments-datasheet-41214435.pdf?src-supplier=Texas+Instruments; ComponentLink1Description: https://datasheet.octopart.com:443/CD4051BE-Texas-Instruments-datasheet-41214435.pdf?src-supplier=Texas+Instruments; ComponentLink2URL: https://octopart.com:443/opatz8j6/c1?t=UIfRW14eXhIfOF-oFZ6Q5J66j7PnUsDjt-DLRZv_ne4_WiumMkbXx4rniWKDRQWco0c1A10nEU92iBnjKMIo5KjEBL51Ak-2lkuqMbbpcID5g9fRMoz5DgekRImzSQik1OPk2t9RJpeedauIwahmVtI3gTHC42d6XSj0Uau-qhabpl_wXRd-29TaXMBJ7wO7fIz0V_HzD_C70tPsu40Tn1cil4nKPp6cB3GfDvcANLGUEQXsGt6YWVv3-ioL5EzUk8hYm1ZisYe4m3mFIzjPX1C895qkWPqY_VotFC2s6MaYWvoNxagzj2oPdc8hXeyaNzAy6VkZktOcbdmdhbAVYym2grw-0VwWrIK_rtRIbd5hGGQdgoqSEIJ3mXl6Yi3iSw&src-supplier=Texas+Instruments; ComponentLink2Description: https://octopart.com:443/opatz8j6/c1?t=UIfRW14eXhIfOF-oFZ6Q5J66j7PnUsDjt-DLRZv_ne4_WiumMkbXx4rniWKDRQWco0c1A10nEU92iBnjKMIo5KjEBL51Ak-2lkuqMbbpcID5g9fRMoz5DgekRImzSQik1OPk2t9RJpeedauIwahmVtI3gTHC42d6XSj0Uau-qhabpl_wXRd-29TaXMBJ7wO7fIz0V_HzD_C70tPsu40Tn1cil4nKPp6cB3GfDvcANLGUEQXsGt6YWVv3-ioL5EzUk8hYm1ZisYe4m3mFIzjPX1C895qkWPqY_VotFC2s6MaYWvoNxagzj2oPdc8hXeyaNzAy6VkZktOcbdmdhbAVYym2grw-0VwWrIK_rtRIbd5hGGQdgoqSEIJ3mXl6Yi3iSw&src-supplier=Texas+Instruments; ComponentLink3URL: https://datasheet.octopart.com:443/CD4051BE-Texas-Instruments-datasheet-148785.pdf?src-supplier=Texas+Instruments; ComponentLink3Description: https://datasheet.octopart.com:443/CD4051BE-Texas-Instruments-datasheet-148785.pdf?src-supplier=Texas+Instruments; ComponentLink4URL: https://sigma.octopart.com:443/49249812/technical_drawing/Texas-Instruments-CD4051BE.pdf?src-supplier=Texas+Instruments; ComponentLink4Description: https://sigma.octopart.com:443/49249812/technical_drawing/Texas-Instruments-CD4051BE.pdf?src-supplier=Texas+Instruments; ComponentLink5URL: https://datasheet.octopart.com:443/CD4051BE-Texas-Instruments-datasheet-10253597.pdf?src-supplier=Farnell; ComponentLink5Description: https://datasheet.octopart.com:443/CD4051BE-Texas-Instruments-datasheet-10253597.pdf?src-supplier=Farnell; ComponentLink6URL: https://datasheet.octopart.com:443/CD4051BE-Texas-Instruments-datasheet-62345999.pdf?src-supplier=Farnell; ComponentLink6Description: https://datasheet.octopart.com:443/CD4051BE-Texas-Instruments-datasheet-62345999.pdf?src-supplier=Farnell; ComponentLink7URL: https://datasheet.octopart.com:443/CD4051BE-Texas-Instruments-datasheet-8384997.pdf?src-supplier=Farnell; ComponentLink7Description: https://datasheet.octopart.com:443/CD4051BE-Texas-Instruments-datasheet-8384997.pdf?src-supplier=Farnell; ComponentLink8URL: https://datasheet.octopart.com:443/CD4051BE-Texas-Instruments-datasheet-10694235.pdf?src-supplier=Farnell; ComponentLink8Description: https://datasheet.octopart.com:443/CD4051BE-Texas-Instruments-datasheet-10694235.pdf?src-supplier=Farnell; ComponentLink9URL: https://datasheet.octopart.com:443/CD4051BE-Texas-Instruments-datasheet-10411452.pdf?src-supplier=Farnell; ComponentLink9Description: https://datasheet.octopart.com:443/CD4051BE-Texas-Instruments-datasheet-10411452.pdf?src-supplier=Farnell; ComponentLink10URL: https://datasheet.octopart.com:443/CD4051BE-Texas-Instruments-datasheet-10189767.pdf?src-supplier=Farnell; ComponentLink10Description: https://datasheet.octopart.com:443/CD4051BE-Texas-Instruments-datasheet-10189767.pdf?src-supplier=Farnell; ComponentLink11URL: https://datasheet.octopart.com:443/CD4051BE-Texas-Instruments-datasheet-8763554.pdf?src-supplier=Farnell; ComponentLink11Description: https://datasheet.octopart.com:443/CD4051BE-Texas-Instruments-datasheet-8763554.pdf?src-supplier=Farnell; ComponentLink12URL: https://datasheet.octopart.com:443/CD4051BE-Texas-Instruments-datasheet-5330332.pdf?src-supplier=Farnell; ComponentLink12Description: https://datasheet.octopart.com:443/CD4051BE-Texas-Instruments-datasheet-5330332.pdf?src-supplier=Farnell; ComponentLink13URL: https://datasheet.octopart.com:443/CD4051BE-Texas-Instruments-datasheet-5364360.pdf?src-supplier=Farnell; ComponentLink13Description: https://datasheet.octopart.com:443/CD4051BE-Texas-Instruments-datasheet-5364360.pdf?src-supplier=Farnell; ComponentLink14URL: https://datasheet.octopart.com:443/CD4051BE-Texas-Instruments-datasheet-17021337.pdf?src-supplier=Future+Electronics; ComponentLink14Description: https://datasheet.octopart.com:443/CD4051BE-Texas-Instruments-datasheet-17021337.pdf?src-supplier=Future+Electronics; ComponentLink15URL: https://datasheet.octopart.com:443/CD4051BE-Texas-Instruments-datasheet-42768.pdf?src-supplier=Mouser; ComponentLink15Description: https://datasheet.octopart.com:443/CD4051BE-Texas-Instruments-datasheet-42768.pdf?src-supplier=Mouser; ComponentLink16URL: https://datasheet.octopart.com:443/CD4051BE-Texas-Instruments-datasheet-159114769.pdf?src-supplier=Burklin+Elektronik; ComponentLink16Description: https://datasheet.octopart.com:443/CD4051BE-Texas-Instruments-datasheet-159114769.pdf?src-supplier=Burklin+Elektronik; ComponentLink17URL: https://datasheet.octopart.com:443/CD4051BE-Texas-Instruments-datasheet-47642707.pdf?src-supplier=TME; ComponentLink17Description: https://datasheet.octopart.com:443/CD4051BE-Texas-Instruments-datasheet-47642707.pdf?src-supplier=TME; ComponentLink18URL: https://datasheet.octopart.com:443/CD4051BE-Texas-Instruments-datasheet-163810140.pdf?src-supplier=SHENGYU+ELECTRONICS; ComponentLink18Description: https://datasheet.octopart.com:443/CD4051BE-Texas-Instruments-datasheet-163810140.pdf?src-supplier=SHENGYU+ELECTRONICS; ComponentLink19URL: https://datasheet.octopart.com:443/CD4051BE-Texas-Instruments-datasheet-163656050.pdf?src-supplier=LCSC; ComponentLink19Description: https://datasheet.octopart.com:443/CD4051BE-Texas-Instruments-datasheet-163656050.pdf?src-supplier=LCSC; ComponentLink20URL: https://datasheet.octopart.com:443/CD4051BE-Texas-Instruments-datasheet-37129006.pdf?src-supplier=Newark; ComponentLink20Description: https://datasheet.octopart.com:443/CD4051BE-Texas-Instruments-datasheet-37129006.pdf?src-supplier=Newark; ComponentLink21URL: https://datasheet.octopart.com:443/CD4051BE-Texas-Instruments-datasheet-21220570.pdf?src-supplier=Newark; ComponentLink21Description: https://datasheet.octopart.com:443/CD4051BE-Texas-Instruments-datasheet-21220570.pdf?src-supplier=Newark; ComponentLink22URL: https://datasheet.octopart.com:443/CD4051BE-Texas-Instruments-datasheet-32026515.pdf?src-supplier=element14+APAC; ComponentLink22Description: https://datasheet.octopart.com:443/CD4051BE-Texas-Instruments-datasheet-32026515.pdf?src-supplier=element14+APAC; ComponentLink23URL: https://datasheet.octopart.com:443/CD4051BE-Texas-Instruments-datasheet-14119637.pdf?src-supplier=iiiC; ComponentLink23Description: https://datasheet.octopart.com:443/CD4051BE-Texas-Instruments-datasheet-14119637.pdf?src-supplier=iiiC; ComponentLink24URL: https://datasheet.octopart.com:443/CD4051BE-Texas-Instruments-datasheet-10104488.pdf?src-supplier=element14; ComponentLink24Description: https://datasheet.octopart.com:443/CD4051BE-Texas-Instruments-datasheet-10104488.pdf?src-supplier=element14; ComponentLink25URL: https://datasheet.octopart.com:443/CD4051BE-Texas-Instruments-datasheet-10059866.pdf?src-supplier=element14; ComponentLink25Description: https://datasheet.octopart.com:443/CD4051BE-Texas-Instruments-datasheet-10059866.pdf?src-supplier=element14; ComponentLink26URL: https://datasheet.octopart.com:443/CD4051BE-Texas-Instruments-datasheet-7280354.pdf?src-supplier=Jameco; ComponentLink26Description: https://datasheet.octopart.com:443/CD4051BE-Texas-Instruments-datasheet-7280354.pdf?src-supplier=Jameco; ComponentLink27URL: https://datasheet.octopart.com:443/CD4051BE-Texas-Instruments-datasheet-38186.pdf?src-supplier=RS+(Formerly+Allied+Electronics); ComponentLink27Description: https://datasheet.octopart.com:443/CD4051BE-Texas-Instruments-datasheet-38186.pdf?src-supplier=RS+(Formerly+Allied+Electronics); ComponentLink28URL: https://datasheet.octopart.com:443/CD4051BE-Texas-Instruments-datasheet-115798.pdf?src-supplier=Sierra+IC; ComponentLink28Description: https://datasheet.octopart.com:443/CD4051BE-Texas-Instruments-datasheet-115798.pdf?src-supplier=Sierra+IC; ComponentLink29URL: http://sigma.octopart.com:80/reach_statement/Texas-Instruments-company-64.pdf?src-supplier=Compliance+Statements; ComponentLink29Description: http://sigma.octopart.com:80/reach_statement/Texas-Instruments-company-64.pdf?src-supplier=Compliance+Statements; ComponentLink30URL: http://sigma.octopart.com:80/conflict_mineral_statement/Texas-Instruments-company-63.pdf?src-supplier=Compliance+Statements; ComponentLink30Description: http://sigma.octopart.com:80/conflict_mineral_statement/Texas-Instruments-company-63.pdf?src-supplier=Compliance+Statements; Supplier Part Number 1: 296-2057-5-ND
U9-U12 = LF411CP: Operational Amplifier, 1 Func, 2000uV Offset-Max, JFET, PDIP8; Manufacturer: Texas Instruments; Manufacturer Lifecycle Status: ACTIVE; Bandwidth: 3MHz; Common Mode Rejection Ratio: 70dB; Dual Supply Voltage: 9V; Input Bias Current: 50pA; Input Offset Voltage (Vos): 800µV; Max Dual Supply Voltage: 18V; Min Dual Supply Voltage: 3.5V; Nominal Supply Current: 2mA; Number of Amplifiers: 1; Slew Rate: 13V/µs; Voltage Gain: 106.02dB; Supplier 1: DigiKey; Manufacturer Part Number: LF411CP; RoHS: Compliant; Category: Amplifiers - Op Amps, Buffer, Instrumentation; Stock 1: 1651; Pricing 1: 1=1.89, 10=1.392, 50=1.1922, 100=1.1302, 250=1.06472, 500=1.02526, 1000=0.99277, 2500=0.95848, 5000=0.93781 (USD); Ambient Temperature Range High: 70°C; Case/Package: PDIP; Gain Bandwidth Product: 3MHz; Height: 5.08mm; Lead Free: Lead Free; Length: 9.81mm; Lifecycle Status: Production; Max Operating Temperature: 70°C; Max Supply Voltage: 18V; Min Operating Temperature: 0°C; Min Supply Voltage: 3.5V; Mount: Through Hole; Number of Channels: 1; Number of Circuits: 1; Number of Elements: 1; Number of Pins: 8; Operating Supply Current: 2mA; Operating Supply Voltage: 18V; Packaging: Rail/Tube; Radiation Hardening: No; REACH SVHC: No; Schedule B: 8542330000, 8542330000|8542330000|8542330000|8542330000|8542330000; Thickness: 3.9mm; Width: 6.35mm; ComponentLink1URL: https://octopart.com:443/opatz8j6/c1?t=ME9Kw5m9dXWfcXky85tAcHSyYlC8apoAZ8-3gre8b_nSina7puu2hP8TwWnfTs3EPeSjX34nqyTitdSFLs_8QGBgHX6ww4XlTFDgyVNlqbWD734mBrk3_tKI5cnxKlAKfKpGQ4qpv40VtQydaFuTpCPyxMtPIXymfvkq-wgZ2iYYC59fUWRRvOqwP5ghjkfPHXa6W8o3ZhqP265dUXWWeYnFDnAQeTWHD9G2zSMM2k3qVNsbcUXv1JY2EX9HSKcvO5VCVgy-f0kGF7zpLYVPUm_lO1vQG-OiufpRT80XQYLiZAB9fTbyyp6S8sS6LBfEamcry8ZtT7mRzWiBFXFYfVMsnVtz1ltjCeQae7iXIE2CNjtUpcme9pxYmzJIEchvww&src-supplier=Texas+Instruments; ComponentLink1Description: https://octopart.com:443/opatz8j6/c1?t=ME9Kw5m9dXWfcXky85tAcHSyYlC8apoAZ8-3gre8b_nSina7puu2hP8TwWnfTs3EPeSjX34nqyTitdSFLs_8QGBgHX6ww4XlTFDgyVNlqbWD734mBrk3_tKI5cnxKlAKfKpGQ4qpv40VtQydaFuTpCPyxMtPIXymfvkq-wgZ2iYYC59fUWRRvOqwP5ghjkfPHXa6W8o3ZhqP265dUXWWeYnFDnAQeTWHD9G2zSMM2k3qVNsbcUXv1JY2EX9HSKcvO5VCVgy-f0kGF7zpLYVPUm_lO1vQG-OiufpRT80XQYLiZAB9fTbyyp6S8sS6LBfEamcry8ZtT7mRzWiBFXFYfVMsnVtz1ltjCeQae7iXIE2CNjtUpcme9pxYmzJIEchvww&src-supplier=Texas+Instruments; ComponentLink2URL: https://datasheet.octopart.com:443/LF411CP-Texas-Instruments-datasheet-10255057.pdf?src-supplier=Texas+Instruments; ComponentLink2Description: https://datasheet.octopart.com:443/LF411CP-Texas-Instruments-datasheet-10255057.pdf?src-supplier=Texas+Instruments; ComponentLink3URL: https://sigma.octopart.com:443/49250158/technical_drawing/Texas-Instruments-LF411CP.pdf?src-supplier=Texas+Instruments; ComponentLink3Description: https://sigma.octopart.com:443/49250158/technical_drawing/Texas-Instruments-LF411CP.pdf?src-supplier=Texas+Instruments; ComponentLink4URL: https://datasheet.octopart.com:443/LF411CP-Texas-Instruments-datasheet-152016.pdf?src-supplier=Texas+Instruments; ComponentLink4Description: https://datasheet.octopart.com:443/LF411CP-Texas-Instruments-datasheet-152016.pdf?src-supplier=Texas+Instruments; ComponentLink5URL: https://datasheet.octopart.com:443/LF411CP-Texas-Instruments-datasheet-149597787.pdf?src-supplier=Upverter; ComponentLink5Description: https://datasheet.octopart.com:443/LF411CP-Texas-Instruments-datasheet-149597787.pdf?src-supplier=Upverter; ComponentLink6URL: https://datasheet.octopart.com:443/LF411CP-Texas-Instruments-datasheet-33010185.pdf?src-supplier=Newark; ComponentLink6Description: https://datasheet.octopart.com:443/LF411CP-Texas-Instruments-datasheet-33010185.pdf?src-supplier=Newark; ComponentLink7URL: https://datasheet.octopart.com:443/LF411CP-Texas-Instruments-datasheet-29029183.pdf?src-supplier=Newark; ComponentLink7Description: https://datasheet.octopart.com:443/LF411CP-Texas-Instruments-datasheet-29029183.pdf?src-supplier=Newark; ComponentLink8URL: https://datasheet.octopart.com:443/LF411CP-Texas-Instruments-datasheet-17727392.pdf?src-supplier=Newark; ComponentLink8Description: https://datasheet.octopart.com:443/LF411CP-Texas-Instruments-datasheet-17727392.pdf?src-supplier=Newark; ComponentLink9URL: https://datasheet.octopart.com:443/LF411CP-Texas-Instruments-datasheet-20723.pdf?src-supplier=Newark; ComponentLink9Description: https://datasheet.octopart.com:443/LF411CP-Texas-Instruments-datasheet-20723.pdf?src-supplier=Newark; ComponentLink10URL: https://datasheet.octopart.com:443/LF411CP-Texas-Instruments-datasheet-8787176.pdf?src-supplier=Verical; ComponentLink10Description: https://datasheet.octopart.com:443/LF411CP-Texas-Instruments-datasheet-8787176.pdf?src-supplier=Verical; ComponentLink11URL: https://datasheet.octopart.com:443/LF411CP-Texas-Instruments-datasheet-8639286.pdf?src-supplier=element14; ComponentLink11Description: https://datasheet.octopart.com:443/LF411CP-Texas-Instruments-datasheet-8639286.pdf?src-supplier=element14; ComponentLink12URL: https://datasheet.octopart.com:443/LF411CP-Texas-Instruments-datasheet-5316506.pdf?src-supplier=element14; ComponentLink12Description: https://datasheet.octopart.com:443/LF411CP-Texas-Instruments-datasheet-5316506.pdf?src-supplier=element14; ComponentLink13URL: https://datasheet.octopart.com:443/LF411CP-Texas-Instruments-datasheet-166161800.pdf?src-supplier=LCSC; ComponentLink13Description: https://datasheet.octopart.com:443/LF411CP-Texas-Instruments-datasheet-166161800.pdf?src-supplier=LCSC; ComponentLink14URL: https://datasheet.octopart.com:443/LF411CP-Texas-Instruments-datasheet-14138788.pdf?src-supplier=iiiC; ComponentLink14Description: https://datasheet.octopart.com:443/LF411CP-Texas-Instruments-datasheet-14138788.pdf?src-supplier=iiiC; ComponentLink15URL: https://datasheet.octopart.com:443/LF411CP-Texas-Instruments-datasheet-124340.pdf?src-supplier=DigiKey; ComponentLink15Description: https://datasheet.octopart.com:443/LF411CP-Texas-Instruments-datasheet-124340.pdf?src-supplier=DigiKey; ComponentLink16URL: https://datasheet.octopart.com:443/LF411CP-Texas-Instruments-datasheet-114211.pdf?src-supplier=Sierra+IC; ComponentLink16Description: https://datasheet.octopart.com:443/LF411CP-Texas-Instruments-datasheet-114211.pdf?src-supplier=Sierra+IC; ComponentLink17URL: http://sigma.octopart.com:80/reach_statement/Texas-Instruments-company-64.pdf?src-supplier=Compliance+Statements; ComponentLink17Description: http://sigma.octopart.com:80/reach_statement/Texas-Instruments-company-64.pdf?src-supplier=Compliance+Statements; ComponentLink18URL: http://sigma.octopart.com:80/conflict_mineral_statement/Texas-Instruments-company-63.pdf?src-supplier=Compliance+Statements; ComponentLink18Description: http://sigma.octopart.com:80/conflict_mineral_statement/Texas-Instruments-company-63.pdf?src-supplier=Compliance+Statements; Supplier Part Number 1: 296-26079-5-ND